# Altium project FINAL_32.PrjPcb
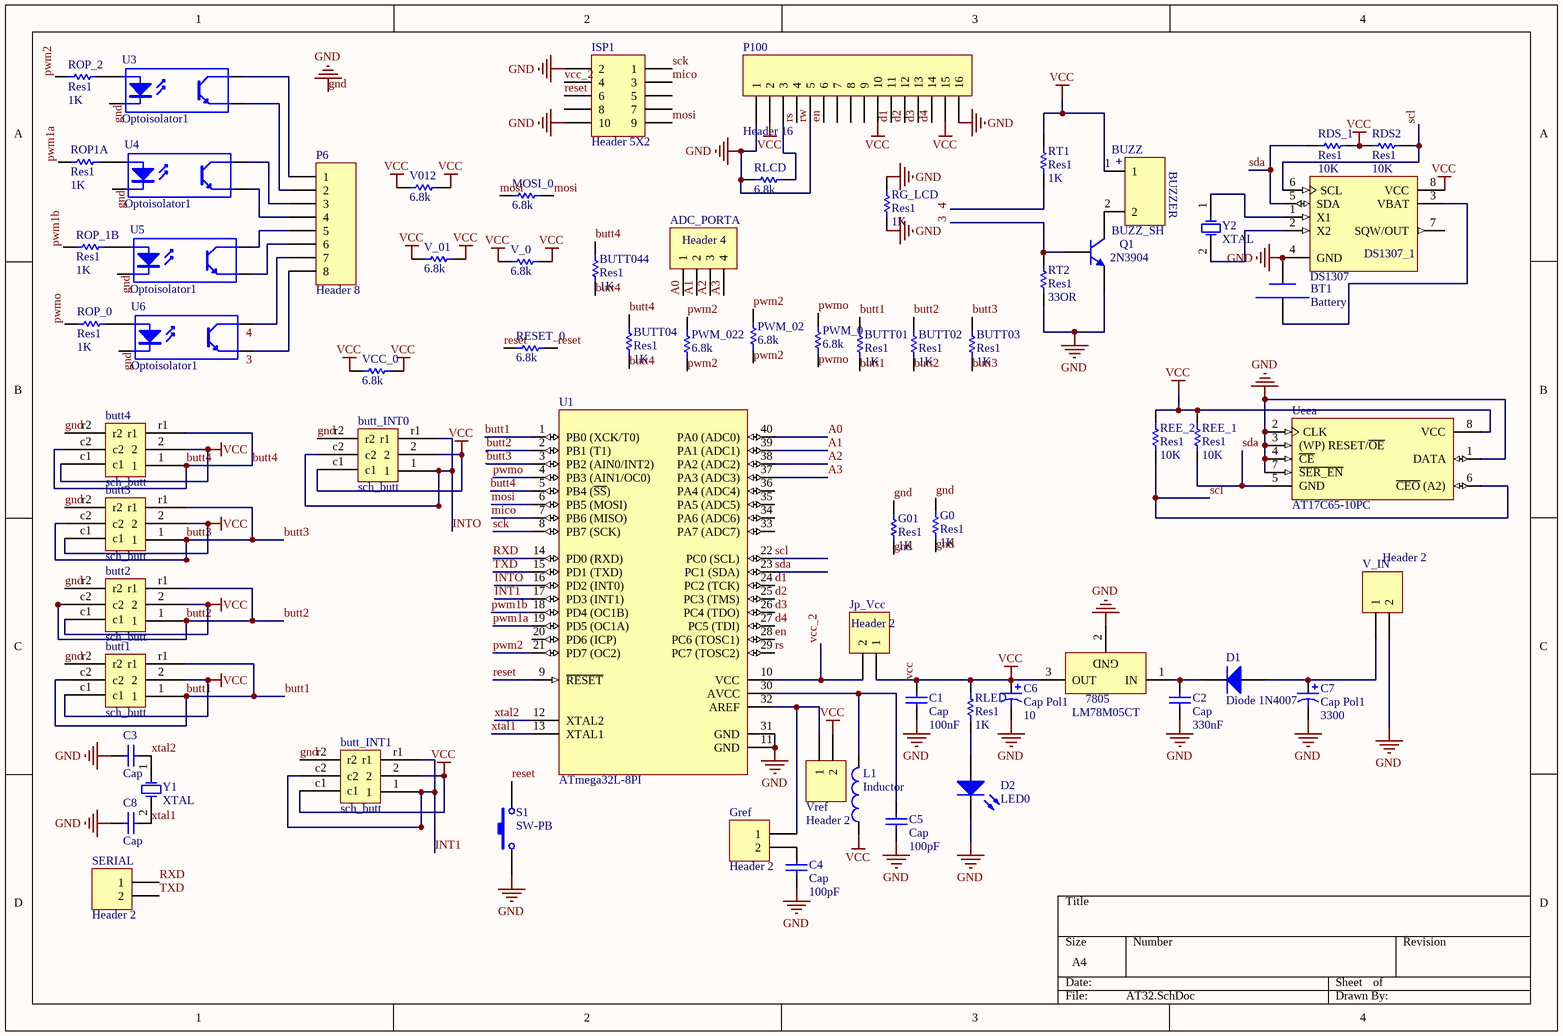
[diagram p0: AT32.SchDoc]
1 sheet, 69 parts. Net scope: global (net labels, ports and power ports of the same name join across sheets).
Board file: AT_32_PCB.PcbDoc

## Sheet AT32.SchDoc
size A4; PageSetup: Record=PageOptions|CenterHorizontal=True|CenterVertical=True|PrintScale=0.97|XCorrection=1.00|YCorrection=1.00|PrintKind=1|BorderSize=5000000|LeftOffset=0|BottomOffset=0|Orientation=2|PaperLength=2970|PaperWidth=2100|Scale=100|PaperSource=4|PrintQuality=600|MediaType=1|DitherType=10|PaperKind=A4|PrintScaleMode=1

### Parts
7805  LM78M05CT  [T03B]
ADC_PORTA  Header 4  [HDR1X4]
BT1  Battery  [BATT]
butt1  sch_butt  [pcb_butt]
BUTT01  Res1  value 1K  [AXIAL-0.3]
butt2  sch_butt  [pcb_butt]
BUTT02  Res1  value 1K  [AXIAL-0.3]
butt3  sch_butt  [pcb_butt]
BUTT03  Res1  value 1K  [AXIAL-0.3]
butt4  sch_butt  [pcb_butt]
BUTT04  Res1  value 1K  [AXIAL-0.3]
BUTT044  Res1  value 1K  [AXIAL-0.3]
butt_INT0  sch_butt  [pcb_butt]
butt_INT1  sch_butt  [pcb_butt]
BUZZ  BUZZ_SH  [BUZZ]
C1  Cap  value 100nF  [RAD-0.1]
C2  Cap  value 330nF  [RAD-0.1]
C3  Cap  [RAD-0.1]
C4  Cap  value 100pF  [RAD-0.1]
C5  Cap  value 100pF  [RAD-0.1]
C6  Cap Pol1  value 10  [C_+]
C7  Cap Pol1  value 3300  [C_+]
C8  Cap  [RAD-0.1]
D1  Diode 1N4007  [DIO10.46-5.3x2.8]
D2  LED0  [LED0]
DS1307_1  DS1307  [DIP8]
G0  Res1  value 1K  [AXIAL-0.3]
G01  Res1  value 1K  [AXIAL-0.3]
Gref  Header 2  [HDR1X2]
ISP1  Header 5X2  [HDR2X5]
Jp_Vcc  Header 2  [HDR1X2]
L1  Inductor  [AXIAL-0.3]
MOSI_0  value 6.8k  [AXIAL-0.3]  (hidden comment: Res1)
P6  Header 8  [HDR1X8]
P100  Header 16  [HDR1X16]
PWM_0  value 6.8k  [AXIAL-0.3]  (hidden comment: Res1)
PWM_02  value 6.8k  [AXIAL-0.3]  (hidden comment: Res1)
PWM_022  value 6.8k  [AXIAL-0.3]  (hidden comment: Res1)
Q1  2N3904  [BCY-W3/E4]
RDS2  Res1  value 10K  [AXIAL-0.3]
RDS_1  Res1  value 10K  [AXIAL-0.3]
REE_1  Res1  value 10K  [AXIAL-0.3]
REE_2  Res1  value 10K  [AXIAL-0.3]
RESET_0  value 6.8k  [AXIAL-0.3]  (hidden comment: Res1)
RG_LCD  Res1  value 1K  [AXIAL-0.3]
RLCD  value 6.8k  [AXIAL-0.3]  (hidden comment: Res1)
RLED  Res1  value 1K  [AXIAL-0.3]
ROP1A  Res1  value 1K  [AXIAL-0.3]
ROP_0  Res1  value 1K  [AXIAL-0.3]
ROP_1B  Res1  value 1K  [AXIAL-0.3]
ROP_2  Res1  value 1K  [AXIAL-0.3]
RT1  Res1  value 1K  [AXIAL-0.3]
RT2  Res1  value 33OR  [AXIAL-0.3]
S1  SW-PB  [HDR1X2]
SERIAL  Header 2  [HDR1X2]
U1  ATmega32L-8PI  [40P6]
U3  Optoisolator1  [DIP-4]
U4  Optoisolator1  [DIP-4]
U5  Optoisolator1  [DIP-4]
U6  Optoisolator1  [DIP-4]
Ueea  AT17C65-10PC  [8P3]
V012  value 6.8k  [AXIAL-0.3]  (hidden comment: Res1)
V_0  value 6.8k  [AXIAL-0.3]  (hidden comment: Res1)
V_01  value 6.8k  [AXIAL-0.3]  (hidden comment: Res1)
V_IN  Header 2  [HDR1X2]
VCC_0  value 6.8k  [AXIAL-0.3]  (hidden comment: Res1)
Vref  Header 2  [HDR1X2]
Y1  XTAL  [CAPR5.08-7.8x3.2]
Y2  XTAL  [CAPR5.08-7.8x3.2]

### Nets
gnd: 7805.2(GND) BT1.1(-) butt1.r2 butt2.r2 butt3.r2 butt4.r2 butt_INT0.r2 butt_INT1.r2 C1.1 C2.1 C3.2 C4.2 C5.1 C6.2 C7.2 C8.2 D2.2(K) DS1307_1.4(GND) G0.1 G0.2 G01.1 G01.2 ISP1.2 ISP1.10 P100.1 P100.5 P100.16 Q1.1(E) RG_LCD.1 RG_LCD.2 RLCD.2 RT2.2 S1.1 U1.11(GND) U1.31(GND) U3.2(K) U4.2(K) U5.2(K) U6.2(K) Ueea.1(DATA) Ueea.2(CLK) Ueea.3((WP)_RESET/~{OE}) Ueea.4(~{CE}) Ueea.7(~{SER_EN}) V_IN.2  [also labelled rw]
vcc: 7805.3(OUT) butt1.2 butt1.c1 butt2.2 butt2.c1 butt3.2 butt3.c1 butt4.2 butt4.c1 butt_INT0.2 butt_INT0.c1 butt_INT1.2 butt_INT1.c1 BUZZ.1 C1.2 C6.1 DS1307_1.8(VCC) Jp_Vcc.1 L1.1 P100.2 P100.10 P100.15 RDS2.2 RDS_1.1 REE_1.2 REE_2.2 RLED.2 RT1.1 Ueea.8(VCC) V012.1 V012.2 V_0.1 V_0.2 V_01.1 V_01.2 VCC_0.1 VCC_0.2 Vref.2
3: P6.8 Q1.2(B) RT2.1 U6.3(E)
4: P6.7 RT1.2 U6.4(C)
A0: ADC_PORTA.1 U1.40(PA0_(ADC0))
A1: ADC_PORTA.2 U1.39(PA1_(ADC1))
A2: ADC_PORTA.3 U1.38(PA2_(ADC2))
A3: ADC_PORTA.4 U1.37(PA3_(ADC3))
butt1: butt1.1 BUTT01.1 BUTT01.2 butt1.c2 butt1.r1 U1.1(PB0_(XCK/T0))
butt2: butt2.1 BUTT02.1 BUTT02.2 butt2.c2 butt2.r1 U1.2(PB1_(T1))
butt3: butt3.1 BUTT03.1 BUTT03.2 butt3.c2 butt3.r1 U1.3(PB2_(AIN0/INT2))
butt4: butt4.1 BUTT04.1 BUTT04.2 butt4.c2 butt4.r1 BUTT044.1 BUTT044.2 U1.5(PB4_(~{SS}))
d1: P100.11 U1.24(PC2_(TCK))
d2: P100.12 U1.25(PC3_(TMS))
d3: P100.13 U1.26(PC4_(TDO))
d4: P100.14 U1.27(PC5_(TDI))
en: P100.6 U1.28(PC6_(TOSC1))
INT1: butt_INT1.1 butt_INT1.c2 butt_INT1.r1 U1.17(PD3_(INT1))
INTO: butt_INT0.1 butt_INT0.c2 butt_INT0.r1 U1.16(PD2_(INT0))
mico: ISP1.3 U1.7(PB6_(MISO))
mosi: ISP1.9 MOSI_0.1 MOSI_0.2 U1.6(PB5_(MOSI))
pwm1a: ROP1A.1 U1.19(PD5_(OC1A))
pwm1b: ROP_1B.1 U1.18(PD4_(OC1B))
pwm2: PWM_02.1 PWM_02.2 PWM_022.1 PWM_022.2 ROP_2.2 U1.21(PD7_(OC2))
pwmo: PWM_0.1 PWM_0.2 ROP_0.1 U1.4(PB3_(AIN1/OC0))
reset: ISP1.6 RESET_0.1 RESET_0.2 S1.2 U1.9(~{RESET})
rs: P100.4 U1.29(PC7_(TOSC2))
RXD: SERIAL.1 U1.14(PD0_(RXD))
sck: ISP1.1 U1.8(PB7_(SCK))
scl: DS1307_1.6(SCL) RDS2.1 REE_2.1 U1.22(PC0_(SCL)) Ueea.6(~{CEO}_(A2))
sda: DS1307_1.5(SDA) RDS_1.2 REE_1.1 U1.23(PC1_(SDA)) Ueea.5(GND)
TXD: SERIAL.2 U1.15(PD1_(TXD))
vcc_2: ISP1.4 Jp_Vcc.2 U1.10(VCC)
xtal1: C8.1 U1.13(XTAL1) Y1.2(OSC2)
xtal2: C3.1 U1.12(XTAL2) Y1.1(OSC1)
Net7805_1: 7805.1(IN) C2.2 D1.2(K)
NetBT1_0: BT1.0(+) DS1307_1.3(VBAT)
NetBUZZ_2: BUZZ.2 Q1.3(C)
NetC4_1: C4.1 Gref.2
NetC5_2: C5.2 L1.2 U1.30(AVCC)
NetC7_1: C7.1 D1.1(A) V_IN.1
NetD2_1: D2.1(A) RLED.1
NetDS1307_1_1: DS1307_1.1(X1) Y2.1(OSC1)
NetDS1307_1_2: DS1307_1.2(X2) Y2.2(OSC2)
NetGref_1: Gref.1 U1.32(AREF) Vref.1
NetP6_1: P6.1 U3.4(C)
NetP6_2: P6.2 U3.3(E)
NetP6_3: P6.3 U4.4(C)
NetP6_4: P6.4 U4.3(E)
NetP6_5: P6.5 U5.4(C)
NetP6_6: P6.6 U5.3(E)
NetP100_3: P100.3 RLCD.1
NetROP1A_2: ROP1A.2 U4.1(A)
NetROP_0_2: ROP_0.2 U6.1(A)
NetROP_1B_2: ROP_1B.2 U5.1(A)
NetROP_2_1: ROP_2.1 U3.1(A)

Not connected (* = marked no-connect by the designer): DS1307_1 7(SQW/OUT); ISP1 5 7 8; P100 7 8 9; U1 20(PD6_(ICP)) 33(PA7_(ADC7)) 34(PA6_(ADC6)) 35(PA5_(ADC5)) 36(PA4_(ADC4))

### Notes on the sheet
- (in symbol BUZZ_SH) +; BUZZER

### Library data of the parts
7805 = LM78M05CT: 3-Terminal Positive Voltage Regulators; Manufacturer: National Semiconductor; CompType: LDO IC; PackageTopMarking: NSUZXYTTE#*LM341T-5.0*LM78M05CT; Published: 4-Dec-2008; DatasheetVersion: Aug-2005; PackageVersion: revL, Jan-1992; PackageReference: T03B; Publisher: Altium Limited; PackageDescription: TO-220, Molded, 3 Lead, Straight; PartNumber: LM78M05CT; RoHS: O; PinCount: 3; DigiKeyPartNumber: LM78M05CT-ND; ComponentLink1Description: LM78M05 Datasheet; ComponentLink1URL: http://www.national.com/ds/LM/LM78M05.pdf; ComponentLink2Description: LM78M05 Web Page; ComponentLink2URL: http://www.national.com/pf/LM/LM78M05.html; ComponentLink3Description: T03B Package Page; ComponentLink3URL: http://www.national.com/packaging/folders/t03b.html
ADC_PORTA = Header 4: Header, 4-Pin; LatestRevisionDate: 17-Jul-2002; LatestRevisionNote: Re-released for DXP Platform.; Publisher: Altium Limited
BT1 = Battery holder: Battery holder CR2032; Designer: Seyed Mohsen Ghasemian; E-mail: picpars@gmail.com; ComponentLinkURL: www.picpars.com; Make: 02/12/2011
BUTT01 BUTT02 BUTT03 BUTT04 BUTT044 G0 G01 MOSI_0 PWM_0 PWM_02 PWM_022 RDS2 RDS_1 REE_1 REE_2 RESET_0 RG_LCD RLCD RLED ROP1A ROP_0 ROP_1B ROP_2 RT1 RT2 V012 V_0 V_01 VCC_0 = Res1: Resistor; Published: 8-Jun-2000; LatestRevisionDate: 17-Jul-2002; LatestRevisionNote: Re-released for DXP Platform.; PackageReference: AXIAL-0.3; Publisher: Altium Limited
C1-C5 C8 = Cap: Capacitor; Published: 8-Jun-2000; LatestRevisionDate: 17-Jul-2002; LatestRevisionNote: Re-released for DXP Platform.; PackageReference: RAD-0.3; Publisher: Altium Limited
C6 C7 = Cap Pol1: Polarized Capacitor (Radial); Published: 8-Jun-2000; LatestRevisionDate: 17-Jul-2002; LatestRevisionNote: Re-released for DXP Platform.; PackageReference: RB7.6-15; Publisher: Altium Limited
D1 = Diode 1N4007: 1 Amp General Purpose Rectifier; Published: 8-Jun-2000; LatestRevisionDate: 17-Jul-2002; LatestRevisionNote: Re-released for DXP Platform.; DatasheetVersion: 1998; PackageVersion: Aug-1999; PackageReference: DO-41; Publisher: Altium Limited; Code_JEDEC: DO-204-AL; ComponentLink1Description: Manufacturer Link; ComponentLink1URL: http://www.fairchildsemi.com/; ComponentLink2Description: Datasheet; ComponentLink2URL: http://www.fairchildsemi.com/ds/1N%2F1N4001.pdf
D2 = LED0: Typical INFRARED GaAs LED; Published: 8-Jun-2000; LatestRevisionDate: 08-Jul-2005; LatestRevisionNote: Mech Layer 1 removed.; PackageReference: LED-0; Publisher: Altium Limited
DS1307_1 = DS1307: 64 X 8 Serial Real-Time Clock; Published: 13-Oct-2000; LatestRevisionDate: 06-Jun-2005; LatestRevisionNote: Stylized 3D Model Added.; DatasheetVersion: 10-Aug-1999; PackageVersion: 1999; PackageReference: DIP8; Publisher: Altium Limited; PackageDescription: DIP; 8 Leads; Row Spacing 7.62 mm; Pitch 2.54 mm; ComponentLink1Description: Manufacturer Link; ComponentLink1URL: http://www.maxim-ic.com/; ComponentLink2Description: Datasheet; ComponentLink2URL: http://pdfserv.maxim-ic.com/en/ds/DS1307.pdf; ComponentLink3Description: Discontinuation Notice; ComponentLink3URL: http://www.maxim-ic.com/qa/pdfs/non-obsolescence-letter.pdf
Gref Jp_Vcc SERIAL V_IN Vref = Header 2: Header, 2-Pin; LatestRevisionDate: 17-Jul-2002; LatestRevisionNote: Re-released for DXP Platform.; Publisher: Altium Limited
ISP1 = Header 5X2: Header, 5-Pin, Dual row; LatestRevisionDate: 17-Jul-2002; LatestRevisionNote: Re-released for DXP Platform.; Publisher: Altium Limited
L1 = Inductor: Code_IEC: 1005; Published: 8-Jun-2000; LatestRevisionDate: 29-May-2009; LatestRevisionNote: IPC-7351 Footprint Added.; PackageReference: 0402-A; Publisher: Altium Limited; PackageDescription: Chip Inductor; Code_JEITA: 0402
P6 = Header 8: Header, 8-Pin; LatestRevisionDate: 17-Jul-2002; LatestRevisionNote: Re-released for DXP Platform.; Publisher: Altium Limited
P100 = Header 16: Header, 16-Pin; LatestRevisionDate: 17-Jul-2002; LatestRevisionNote: Re-released for DXP Platform.; Publisher: Altium Limited
Q1 = 2N3904: NPN General Purpose Amplifier; Published: 8-Jun-2000; LatestRevisionDate: 15-Jan-2003; LatestRevisionNote: PCB Footprint 'BCY-W3/D4.7' replaced; DatasheetVersion: 1997; PackageVersion: Sep-1998; PackageReference: TO-92A; Publisher: Altium Limited; Code_JEDEC: TO-92A; ComponentLink1Description: Manufacturer Link; ComponentLink1URL: http://www.fairchildsemi.com/; ComponentLink2Description: Datasheet; ComponentLink2URL: http://www.fairchildsemi.com/ds/2N%2F2N3904.pdf
S1 = SW-PB: Switch; Published: 24-Mar-1999; LatestRevisionDate: 17-Jul-2002; LatestRevisionNote: Re-released for DXP Platform.; PackageReference: SPST-2; Publisher: Altium Limited
U1 = ATmega32L-8PI: 8-Bit AVR Microcontroller with 32K Bytes of In-System Programmable Flash Memory; Published: 17-Sep-2003; LatestRevisionDate: 04-Mar-2005; LatestRevisionNote: Stylized 3D Model Added.; DatasheetVersion: 2503C-AVR-10/02; PackageVersion: Dec-1999; PackageReference: 40P6; Publisher: Altium Limited; PackageDescription: DIP; 40 Leads; Row Spacing 15.24 mm; Pitch 2.54 mm; ComponentLink1Description: Manufacturer Link; ComponentLink1URL: http://www.atmel.com; ComponentLink2Description: Datasheet; ComponentLink2URL: http://www.atmel.com/dyn/resources/prod_documents/doc2503.pdf
U3-U6 = Optoisolator1: 4-Pin Phototransistor Optocoupler; Published: 24-Mar-1999; LatestRevisionDate: 04-Mar-2005; LatestRevisionNote: Sch pins 3 & 4 Swapped.; DatasheetVersion: Nov-2003; PackageReference: DIP-4; Publisher: Altium Limited
Ueea = AT17C65-10PC: FPGA Configuration EEPROM 64K Memory; Published: 17-Jul-2002; LatestRevisionDate: 04-Mar-2005; LatestRevisionNote: Stylized 3D Model Added.; DatasheetVersion: Rev. 1636B-05/00; PackageReference: 8P3; Publisher: Altium Limited; PackageDescription: DIP; 8 Leads; Row Spacing 7.62 mm; Pitch 2.54 mm; ComponentLink1Description: Manufacturer Link; ComponentLink1URL: http://www.atmel.com; ComponentLink2Description: Datasheet; ComponentLink2URL: http://www.atmel.com/dyn/resources/prod_documents/doc2321.pdf
Y1 Y2 = XTAL: Crystal Oscillator; Published: 8-Jun-2000; LatestRevisionDate: 17-Jul-2002; LatestRevisionNote: Re-released for DXP Platform.; PackageReference: R38; Publisher: Altium Limited